# Altium project EC3micro.PrjPcb
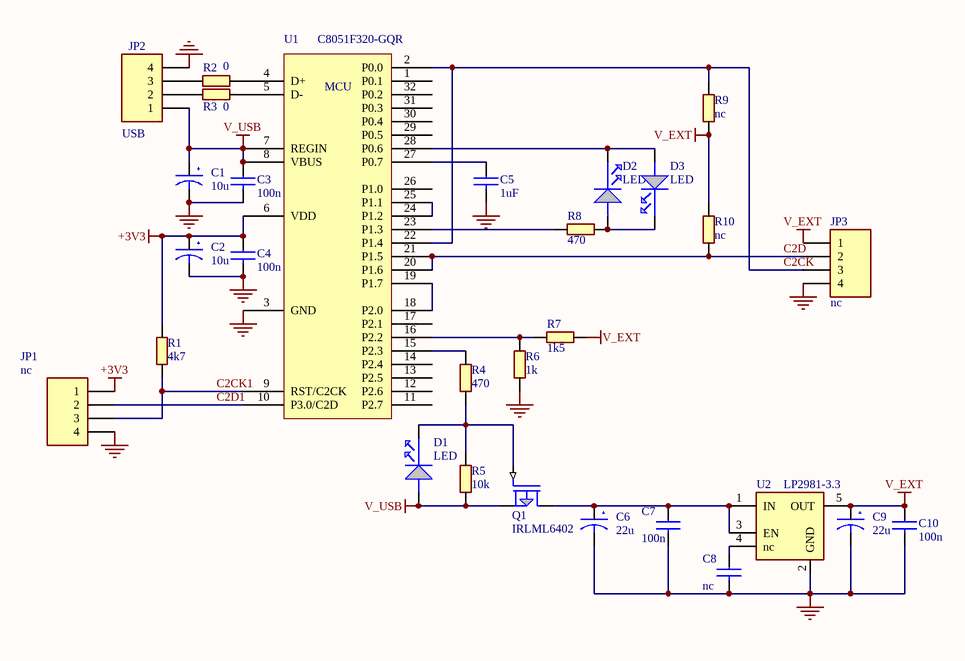
[diagram p0: EC3micro.SchDoc]
1 sheet, 29 parts. Net scope: global (net labels, ports and power ports of the same name join across sheets).
Board file: EC3micro.PcbDoc

## Sheet EC3micro.SchDoc
size A4

### Parts
C1  10u  [TANTAL-A]
C2  10u  [TANTAL-A]
C3  100n  [C-0603]
C4  100n  [C-0603]
C5  1uF  [C-0805]
C6  22u  [TANTAL-A]
C7  100n  [C-0603]
C8  nc  [C-0603]
C9  22u  [TANTAL-A]
C10  100n  [C-0603]
D1  LED  [LED-0805]
D2  LED  [LED-0805]
D3  LED  [LED-0805]
JP1  nc  [IDS1-4P]
JP2  USB  [CONN4_long]
JP3  nc  [CONN4_long]
Q1  IRLML6402  [SOT-23]
R1  4k7  [R-0603]
R2  0  [R-0603]
R3  0  [R-0603]
R4  470  [R-0603]
R5  10k  [R-0603]
R6  1k  [R-0603]
R7  1k5  [R-0603]
R8  470  [R-0603]
R9  nc  [R-0603]
R10  nc  [R-0603]
U1  C8051F320-GQR  [QFP32]
U2  LP2981-3.3  [SOT-23-5]

### Nets
+3V3: C2.2(+) C4.1 JP1.1 R1.2 U1.6(VDD)
GND: C1.1(-) C2.1(-) C3.2 C4.2 C5.2 C6.1(-) C7.2 C8.2 C9.1(-) C10.2 JP1.4 JP2.4 JP3.4 R6.1 U1.3(GND) U2.2(GND)
V_EXT: C9.2(+) C10.1 JP3.1 R7.2 R9.1 R10.2 U2.5(OUT)
V_USB: C1.2(+) C3.1 D1.A(ANODE) JP2.1 Q1.3(SOURCE) R5.1 U1.7(REGIN) U1.8(VBUS)
C2CK: JP3.3 R9.2 U1.2(P0.0) U1.22(P1.4)
C2CK1: JP1.3 R1.1 U1.9(RST/C2CK)
C2D: JP3.2 R10.1 U1.20(P1.6) U1.21(P1.5)
C2D1: JP1.2 U1.10(P3.0/C2D)
NetC5_1: C5.1 U1.27(P0.7)
NetC6_2: C6.2(+) C7.1 Q1.2(DRAIN) U2.1(IN) U2.3(EN)
NetC8_1: C8.1 U2.4(nc)
NetD1_K: D1.K(CATHODE) Q1.1(GATE) R4.1 R5.2
NetD2_A: D2.A(ANODE) D3.K(CATHODE) R8.2
NetD2_K: D2.K(CATHODE) D3.A(ANODE) U1.28(P0.6)
NetJP2_2: JP2.2 R3.1
NetJP2_3: JP2.3 R2.1
NetR2_2: R2.2 U1.4(D+)
NetR3_2: R3.2 U1.5(D-)
NetR4_2: R4.2 U1.15(P2.3)
NetR6_2: R6.2 R7.1 U1.16(P2.2)
NetR8_1: R8.1 U1.23(P1.3)
NetU1_18: U1.18(P2.0) U1.19(P1.7)
NetU1_24: U1.24(P1.2) U1.25(P1.1)

Not connected (* = marked no-connect by the designer): U1 1(P0.1) 11(P2.7) 12(P2.6) 13(P2.5) 14(P2.4) 17(P2.1) 26(P1.0) 29(P0.5) 30(P0.4) 31(P0.3) 32(P0.2)

### Notes on the sheet
- (in symbol C8051F320) MCU

### Library data of the parts
C1 C2 C6 C9 = C-EL-TAN: Производитель: *; Точность: *; Напряжение: *; Тип диэлектрика: *
C3-C5 C7 C8 C10 = C: Производитель: *; Точность: *; Напряжение: *; Тип диэлектрика: *
JP1-JP3 = HEADER 4: 4 Pin Header 2,0 mm, 1x04; Part Field 1: CviLux
R1-R10 = RES: Part Field 1: UniOhm; Part Field 7: 5%; Part Field 8: SMD
U1 = C8051F320